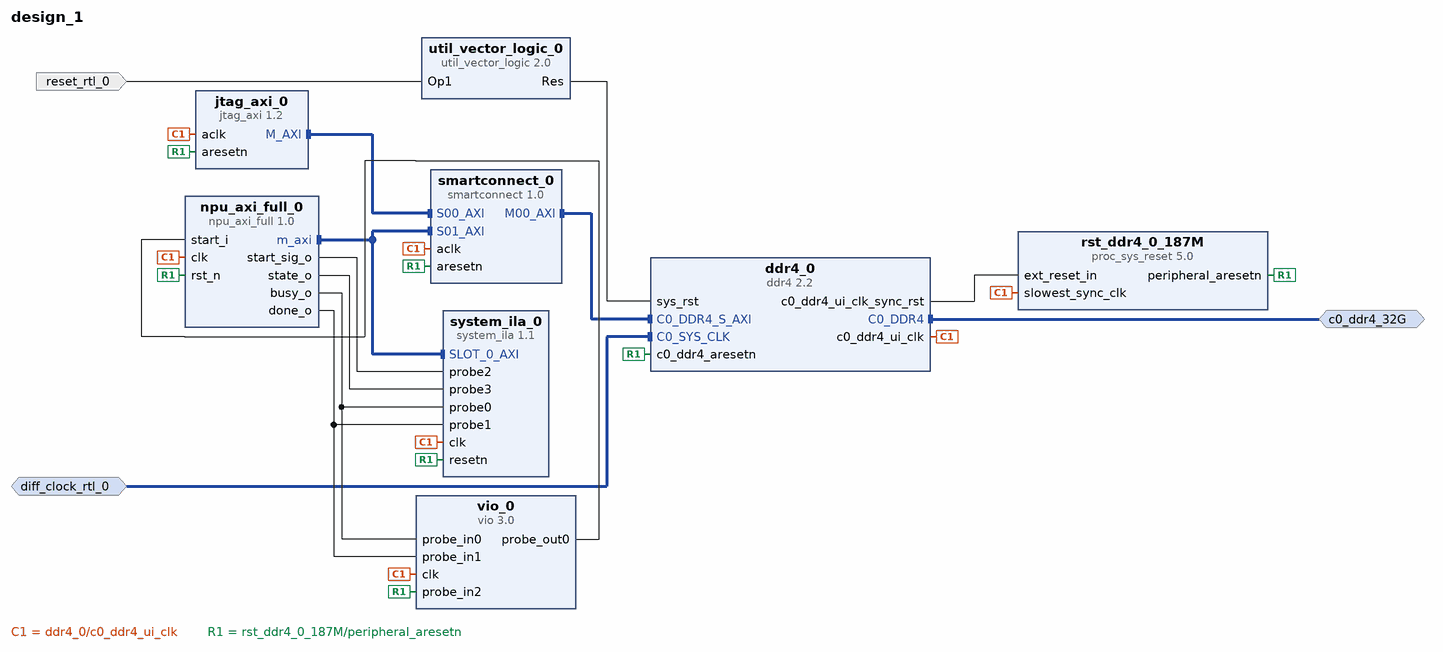
[diagram p0: block diagram of the top level]
# Vivado block design design_1, xcvu13p-fhgb2104-2-e, Vivado 2025.2
create_bd_design design_1

create_bd_intf_port -mode Master -vlnv xilinx.com:interface:ddr4_rtl:1.0 c0_ddr4_32G
create_bd_intf_port -mode Slave -vlnv xilinx.com:interface:diff_clock_rtl:1.0 diff_clock_rtl_0
set_property -dict {CONFIG.FREQ_HZ 300000000} [get_bd_intf_ports diff_clock_rtl_0]
create_bd_port -dir I -type rst reset_rtl_0
set_property -dict {CONFIG.POLARITY ACTIVE_LOW} [get_bd_ports reset_rtl_0]

create_bd_cell -type ip -vlnv xilinx.com:ip:ddr4:2.2 ddr4_0
set_property -dict [list \
  CONFIG.C0.CKE_WIDTH 2 \
  CONFIG.C0.CK_WIDTH 2 \
  CONFIG.C0.CS_WIDTH 2 \
  CONFIG.C0.DDR4_AxiAddressWidth 35 \
  CONFIG.C0.DDR4_AxiDataWidth 512 \
  CONFIG.C0.DDR4_CasLatency 14 \
  CONFIG.C0.DDR4_CasWriteLatency 12 \
  CONFIG.C0.DDR4_CustomParts ../../../../imports/jasper/Bob2_32GB_DDR4.csv \
  CONFIG.C0.DDR4_DataWidth 64 \
  CONFIG.C0.DDR4_InputClockPeriod 3333 \
  CONFIG.C0.DDR4_MemoryPart MTA16ATF4G64HZ-4 \
  CONFIG.C0.DDR4_MemoryType SODIMMs \
  CONFIG.C0.DDR4_TimePeriod 1333 \
  CONFIG.C0.DDR4_isCustom true \
  CONFIG.C0.ODT_WIDTH 2 \
] [get_bd_cells ddr4_0]
create_bd_cell -type ip -vlnv xilinx.com:ip:jtag_axi:1.2 jtag_axi_0
create_bd_cell -type ip -vlnv xilinx.com:ip:vio:3.0 vio_0
set_property -dict {CONFIG.C_NUM_PROBE_IN 3 CONFIG.C_NUM_PROBE_OUT 1} [get_bd_cells vio_0]
create_bd_cell -type ip -vlnv xilinx.com:ip:smartconnect:1.0 smartconnect_0
create_bd_cell -type ip -vlnv xilinx.com:ip:proc_sys_reset:5.0 rst_ddr4_0_187M
create_bd_cell -type ip -vlnv xilinx.com:ip:util_vector_logic:2.0 util_vector_logic_0
set_property -dict {CONFIG.C_OPERATION not CONFIG.C_SIZE 1} [get_bd_cells util_vector_logic_0]
create_bd_cell -type ip -vlnv user.org:user:npu_axi_full:1.0 npu_axi_full_0
set_property -dict {CONFIG.DATA_WIDTH 128} [get_bd_cells npu_axi_full_0]
create_bd_cell -type ip -vlnv xilinx.com:ip:system_ila:1.1 system_ila_0
set_property -dict [list \
  CONFIG.C_MON_TYPE MIX \
  CONFIG.C_NUM_MONITOR_SLOTS 1 \
  CONFIG.C_NUM_OF_PROBES 4 \
  CONFIG.C_PROBE0_TYPE 0 \
  CONFIG.C_PROBE1_TYPE 0 \
  CONFIG.C_PROBE2_TYPE 0 \
  CONFIG.C_PROBE3_TYPE 0 \
  CONFIG.C_SLOT_0_APC_EN 0 \
  CONFIG.C_SLOT_0_AXI_AR_SEL_DATA 1 \
  CONFIG.C_SLOT_0_AXI_AR_SEL_TRIG 1 \
  CONFIG.C_SLOT_0_AXI_AW_SEL_DATA 1 \
  CONFIG.C_SLOT_0_AXI_AW_SEL_TRIG 1 \
  CONFIG.C_SLOT_0_AXI_B_SEL_DATA 1 \
  CONFIG.C_SLOT_0_AXI_B_SEL_TRIG 1 \
  CONFIG.C_SLOT_0_AXI_R_SEL_DATA 1 \
  CONFIG.C_SLOT_0_AXI_R_SEL_TRIG 1 \
  CONFIG.C_SLOT_0_AXI_W_SEL_DATA 1 \
  CONFIG.C_SLOT_0_AXI_W_SEL_TRIG 1 \
  CONFIG.C_SLOT_0_INTF_TYPE xilinx.com:interface:aximm_rtl:1.0 \
] [get_bd_cells system_ila_0]

# ---- connections ----

connect_bd_intf_net [get_bd_intf_ports c0_ddr4_32G] [get_bd_intf_pins ddr4_0/C0_DDR4]
connect_bd_intf_net -intf_net diff_clock_rtl_0_1 [get_bd_intf_ports diff_clock_rtl_0] [get_bd_intf_pins ddr4_0/C0_SYS_CLK]
connect_bd_intf_net [get_bd_intf_pins jtag_axi_0/M_AXI] [get_bd_intf_pins smartconnect_0/S00_AXI]
connect_bd_intf_net -intf_net npu_axi_full_0_m_axi [get_bd_intf_pins npu_axi_full_0/m_axi] [get_bd_intf_pins smartconnect_0/S01_AXI]
connect_bd_intf_net [get_bd_intf_pins npu_axi_full_0/m_axi] [get_bd_intf_pins system_ila_0/SLOT_0_AXI]
connect_bd_intf_net [get_bd_intf_pins smartconnect_0/M00_AXI] [get_bd_intf_pins ddr4_0/C0_DDR4_S_AXI]
connect_bd_net [get_bd_pins ddr4_0/c0_ddr4_ui_clk] \
  [get_bd_pins jtag_axi_0/aclk] [get_bd_pins rst_ddr4_0_187M/slowest_sync_clk] [get_bd_pins smartconnect_0/aclk] \
  [get_bd_pins vio_0/clk] [get_bd_pins system_ila_0/clk] [get_bd_pins npu_axi_full_0/clk]
connect_bd_net [get_bd_pins ddr4_0/c0_ddr4_ui_clk_sync_rst] [get_bd_pins rst_ddr4_0_187M/ext_reset_in]
connect_bd_net -net npu_axi_full_0_busy_o [get_bd_pins npu_axi_full_0/busy_o] [get_bd_pins vio_0/probe_in0] [get_bd_pins system_ila_0/probe0]
connect_bd_net -net npu_axi_full_0_done_o [get_bd_pins npu_axi_full_0/done_o] [get_bd_pins vio_0/probe_in1] [get_bd_pins system_ila_0/probe1]
connect_bd_net -net reset_rtl_0_1 [get_bd_ports reset_rtl_0] [get_bd_pins util_vector_logic_0/Op1]
connect_bd_net [get_bd_pins rst_ddr4_0_187M/peripheral_aresetn] \
  [get_bd_pins ddr4_0/c0_ddr4_aresetn] [get_bd_pins jtag_axi_0/aresetn] [get_bd_pins smartconnect_0/aresetn] \
  [get_bd_pins vio_0/probe_in2] [get_bd_pins system_ila_0/resetn] [get_bd_pins npu_axi_full_0/rst_n]
connect_bd_net -net start_pulse_o [get_bd_pins npu_axi_full_0/start_sig_o] [get_bd_pins system_ila_0/probe2]
connect_bd_net -net state_o [get_bd_pins npu_axi_full_0/state_o] [get_bd_pins system_ila_0/probe3]
connect_bd_net [get_bd_pins util_vector_logic_0/Res] [get_bd_pins ddr4_0/sys_rst]
connect_bd_net [get_bd_pins vio_0/probe_out0] [get_bd_pins npu_axi_full_0/start_i]
set_property HDL_ATTRIBUTE.DEBUG true [get_bd_intf_nets npu_axi_full_0_m_axi]
set_property HDL_ATTRIBUTE.MARK_DEBUG true [get_bd_intf_nets npu_axi_full_0_m_axi]
set_property HDL_ATTRIBUTE.DEBUG true [get_bd_nets npu_axi_full_0_busy_o]
set_property HDL_ATTRIBUTE.MARK_DEBUG true [get_bd_nets npu_axi_full_0_busy_o]
set_property HDL_ATTRIBUTE.DEBUG true [get_bd_nets npu_axi_full_0_done_o]
set_property HDL_ATTRIBUTE.MARK_DEBUG true [get_bd_nets npu_axi_full_0_done_o]
set_property HDL_ATTRIBUTE.DEBUG true [get_bd_nets start_pulse_o]
set_property HDL_ATTRIBUTE.MARK_DEBUG true [get_bd_nets start_pulse_o]
set_property HDL_ATTRIBUTE.DEBUG true [get_bd_nets state_o]
set_property HDL_ATTRIBUTE.MARK_DEBUG true [get_bd_nets state_o]

# ---- address map ----
assign_bd_address -offset 0x00000000 -range 4G -target_address_space [get_bd_addr_spaces jtag_axi_0/Data] [get_bd_addr_segs ddr4_0/C0_DDR4_MEMORY_MAP/C0_DDR4_ADDRESS_BLOCK]
assign_bd_address -offset 0x00000000 -range 4G -target_address_space [get_bd_addr_spaces npu_axi_full_0/m_axi] [get_bd_addr_segs ddr4_0/C0_DDR4_MEMORY_MAP/C0_DDR4_ADDRESS_BLOCK]

validate_bd_design
save_bd_design
